# Altium schematic sheet Sheet1.SchDoc
size A4
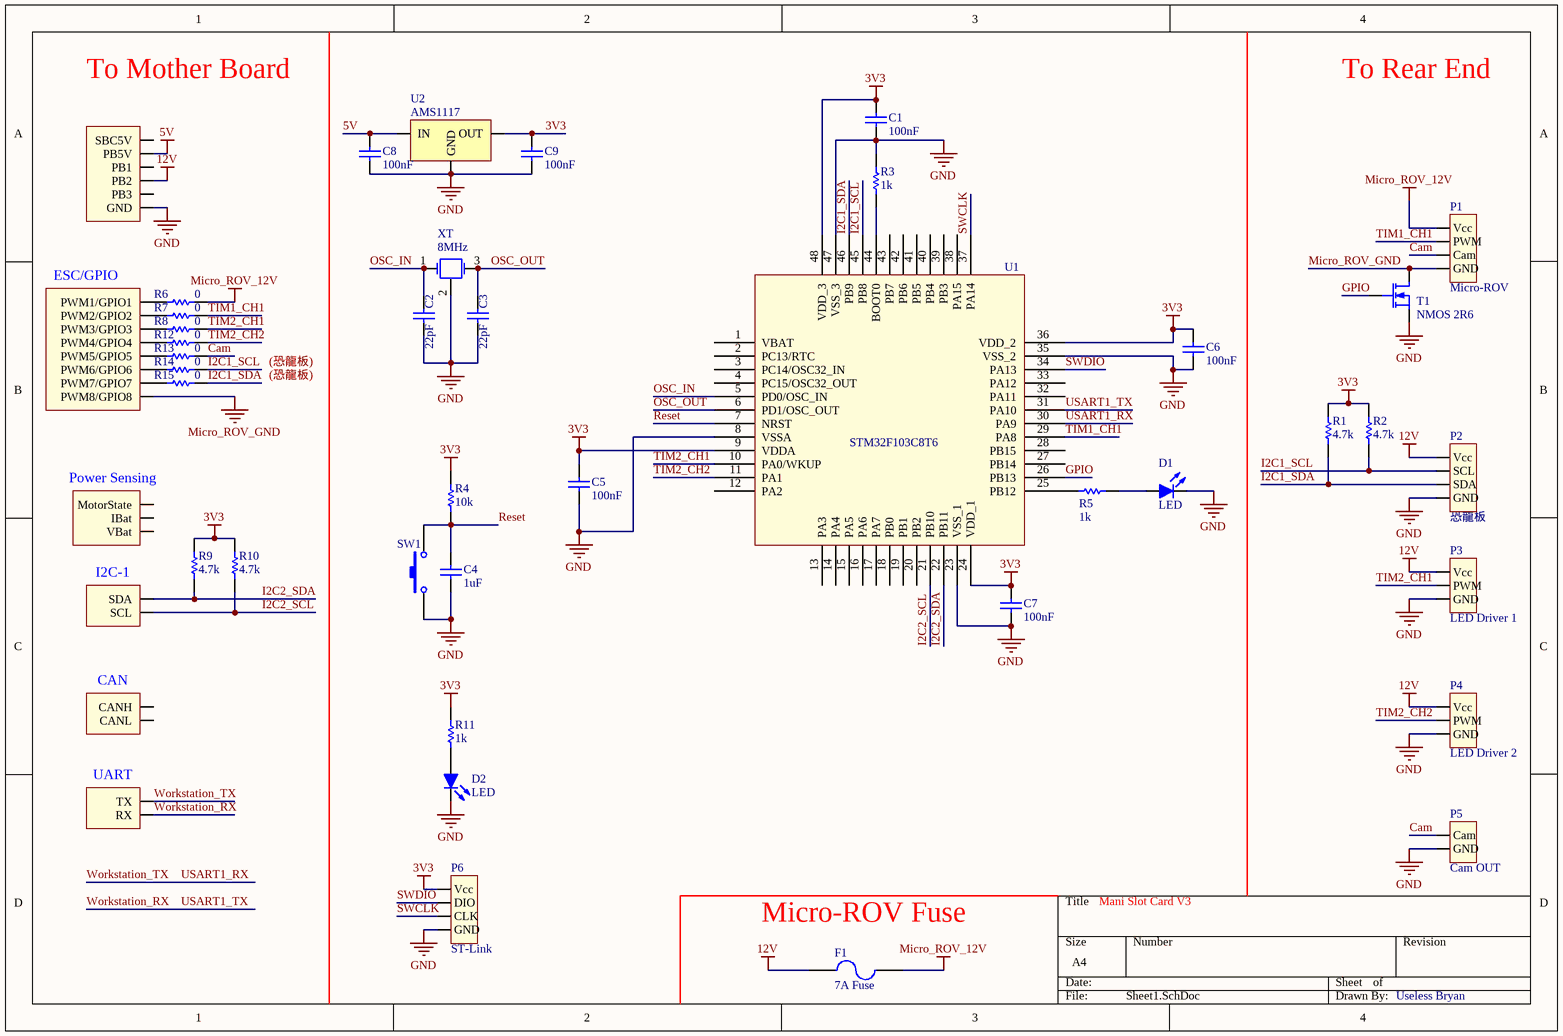
[diagram p0: Sheet1.SchDoc]

## Parts
C1  100nF  [C0805]
C2  22pF  [C0805]
C3  22pF  [C0805]
C4  1uF  [C0805]
C5  100nF  [C0805]
C6  100nF  [C0805]
C7  100nF  [C0805]
C8  100nF  [C0805]
C9  100nF  [C0805]
Con1  2x10pin  [2x10pin]  (value not drawn)  (parts A,B,C,D,E of 5)
Con2  2x6pin  [2x6pin]  (value not drawn)
D1  LED  [LED-0805]
D2  LED  [LED-0805]
F1  7A Fuse  [FUSE-BLXA]
P1  Micro-ROV  [XH2.54-4PIN_SMD]
P2  Hung Lone V1  [XH2.54-4PIN_SMD]  (value not drawn)
P3  LED Driver 1  [XH2.54-3Pin_SMD]
P4  LED Driver 2  [XH2.54-3Pin_SMD]
P5  Cam OUT  [XH2.54-2Pin_SMD]
P6  ST-Link  [XH2.54-4pin]
R1  4.7k  [R0805]
R2  4.7k  [R0805]
R3  1k  [R0805]
R4  10k  [R0805]
R5  1k  [R0805]
R6  0  [R1206]
R7  0  [R0603]
R8  0  [R0603]
R9  4.7k  [R0805]
R10  4.7k  [R0805]
R11  1k  [R0805]
R12  0  [R0603]
R13  0  [R0603]
R14  0  [R0603]
R15  0  [R0603]
SW1  SW-PB  [Switch-2pin]  (value not drawn)
T1  NMOS 2R6  [TPH2R608NH]
U1  STM32F103C8T6  [LQFP48]
U2  AMS1117  [SOT-223]
XT  8MHz  [3225-P]

## Nets
3V3: C1.2 C5.2 C6.2 C7.2 C9.2 P6.1(Vcc) R1.2 R2.2 R4.2 R9.2 R10.2 R11.2 U1.9(VDDA) U1.24(VDD_1) U1.36(VDD_2) U1.48(VDD_3) U2.2(OUT)
5V: C8.2 Con2.2(PB5V) U2.3(IN)
12V: Con2.4(PB2) F1.1 P2.1(Vcc) P3.1(Vcc) P4.1(Vcc)
GND: C1.1 C2.1 C3.1 C4.1 C5.1 C6.1 C7.1 C8.1 C9.1 Con2.6(GND) D1.2(K) D2.2(K) P2.4(GND) P3.3(GND) P4.3(GND) P5.2(GND) P6.4(GND) R3.2 SW1.1 T1.3(S) U1.8(VSSA) U1.23(VSS_1) U1.35(VSS_2) U1.47(VSS_3) U2.1(GND) XT.2
Micro_ROV_12V: F1.2 P1.1(Vcc) R6.2
Micro_ROV_GND: Con1.8(PWM8/GPIO8) P1.4(GND) T1.1(D)
Cam: P1.3(Cam) P5.1(Cam) R13.2
GPIO: T1.2(G) U1.26(PB13)
I2C1_SCL: P2.2(SCL) R2.1 R14.2 U1.45(PB8)
I2C1_SDA: P2.3(SDA) R1.1 R15.2 U1.46(PB9)
I2C2_SCL: Con1.14(SCL) R10.1 U1.21(PB10)
I2C2_SDA: Con1.13(SDA) R9.1 U1.22(PB11)
OSC_IN: C2.2 U1.5(PD0/OSC_IN) XT.1(OSC1)
OSC_OUT: C3.2 U1.6(PD1/OSC_OUT) XT.3(OSC2)
Reset: C4.2 R4.1 SW1.2 U1.7(NRST)
SWCLK: P6.3(CLK) U1.37(PA14)
SWDIO: P6.2(DIO) U1.34(PA13)
TIM1_CH1: P1.2(PWM) R7.2 U1.29(PA8)
TIM2_CH1: P3.2(PWM) R8.2 U1.10(PA0/WKUP)
TIM2_CH2: P4.2(PWM) R12.2 U1.11(PA1)
USART1_RX: Con1.19(TX) U1.30(PA9)  [also labelled Workstation_TX]
USART1_TX: Con1.20(RX) U1.31(PA10)  [also labelled Workstation_RX]
NetCon1_1: Con1.1(PWM1/GPIO1) R6.1
NetCon1_2: Con1.2(PWM2/GPIO2) R7.1
NetCon1_3: Con1.3(PWM3/GPIO3) R8.1
NetCon1_4: Con1.4(PWM4/GPIO4) R12.1
NetCon1_5: Con1.5(PWM5/GPIO5) R13.1
NetCon1_6: Con1.6(PWM6/GPIO6) R14.1
NetCon1_7: Con1.7(PWM7/GPIO7) R15.1
NetD1_1: D1.1(A) R5.2
NetD2_1: D2.1(A) R11.1
NetR3_1: R3.1 U1.44(BOOT0)
NetR5_1: R5.1 U1.25(PB12)

Not connected (* = marked no-connect by the designer): Con1 10(MotorState) 11(IBat) 12(VBat) 15(CANH) 16(CANL); Con2 1(SBC5V) 3(PB1) 5(PB3); U1 1(VBAT) 2(PC13/RTC) 3(PC14/OSC32_IN) 4(PC15/OSC32_OUT) 12(PA2) 13(PA3) 14(PA4) 15(PA5) 16(PA6) 17(PA7) 18(PB0) 19(PB1) 20(PB2) 27(PB14) 28(PB15) 32(PA11) 33(PA12) 38(PA15) 39(PB3) 40(PB4) 41(PB5) 42(PB6) 43(PB7)

## Notes on the sheet
- To Mother Board
- To Rear End
- (恐龍板)
- (near P2) 恐龍板
- (near F1) Micro-ROV Fuse
- Mani Slot Card V3
- Useless Bryan
- (in symbol 2x10pin, part A) ESC/GPIO
- (in symbol 2x10pin, part B) Power Sensing
- (in symbol 2x10pin, part C) I2C-1
- (in symbol 2x10pin, part D) CAN
- (in symbol 2x10pin, part E) UART

## Library data of the parts
C1-C9 = Cap: value: *
F1 = Fuse
P1 P2 P6 = 4Pin
P3 P4 = 3Pin
P5 = 2Pin
R1 R2 R4 = Resistor: pull-up resistor; value: *
R3 R5-R15 = Resistor: value: *
T1 = MOSFET-N
XT = Passive Crystal: frequency: *